# EasyEDA Pro project FPV_GROUND_STATION_SOURCE.epro

# Schematic Schematic1

## Sheets
1 POWER_BLK: Board Name: Board1; Create Date: 2026-05-17; Page Name: POWER_BLK; Project Name: JulyMonitor_uHAT; Schematic Name: Schematic1; Update Date: 2026-05-17; Company: EasyEDA.com; Page Size: A4; Version: V1.0
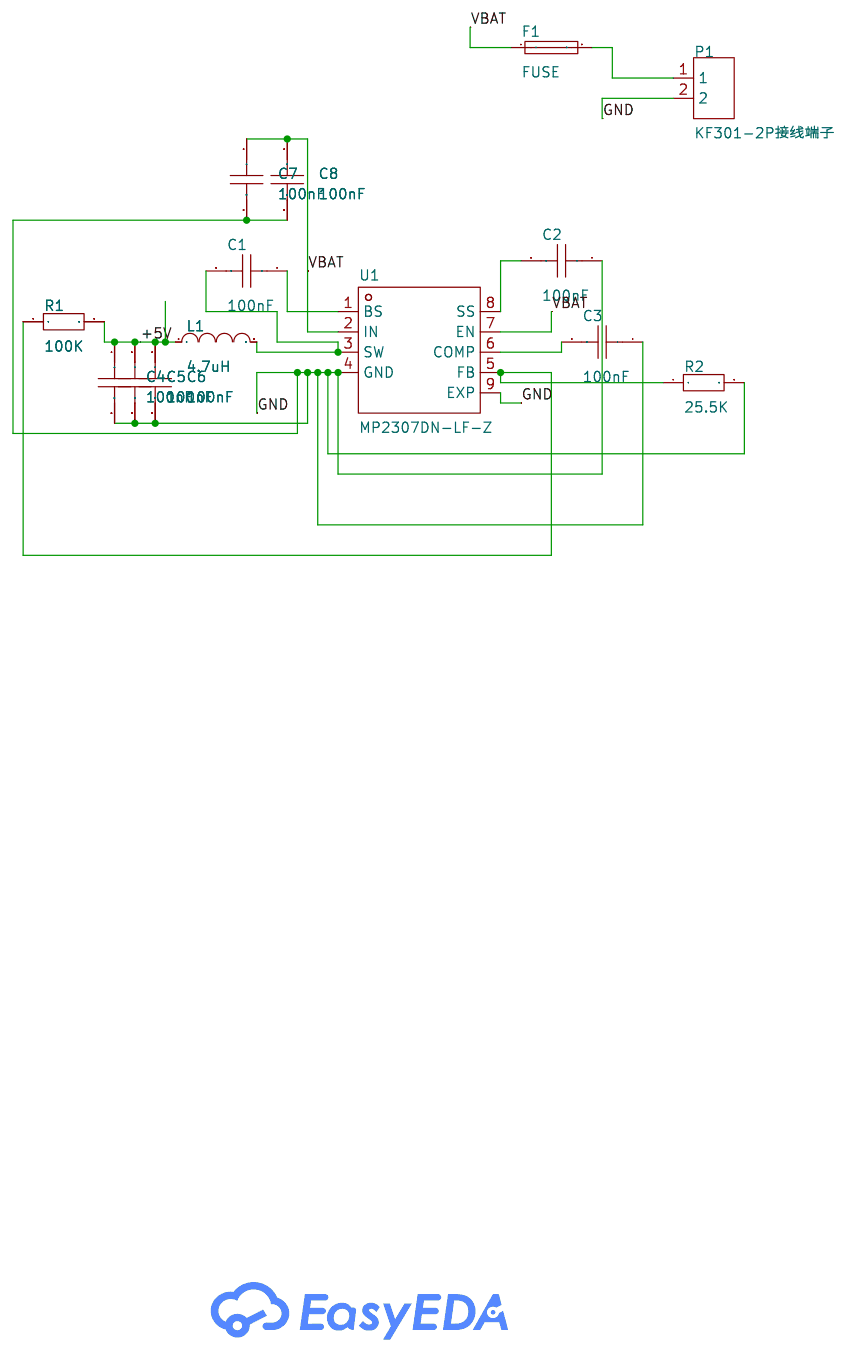
[diagram p0: POWER_BLK]
2 GPIO header + USB-A: Page Name: GPIO header + USB-A
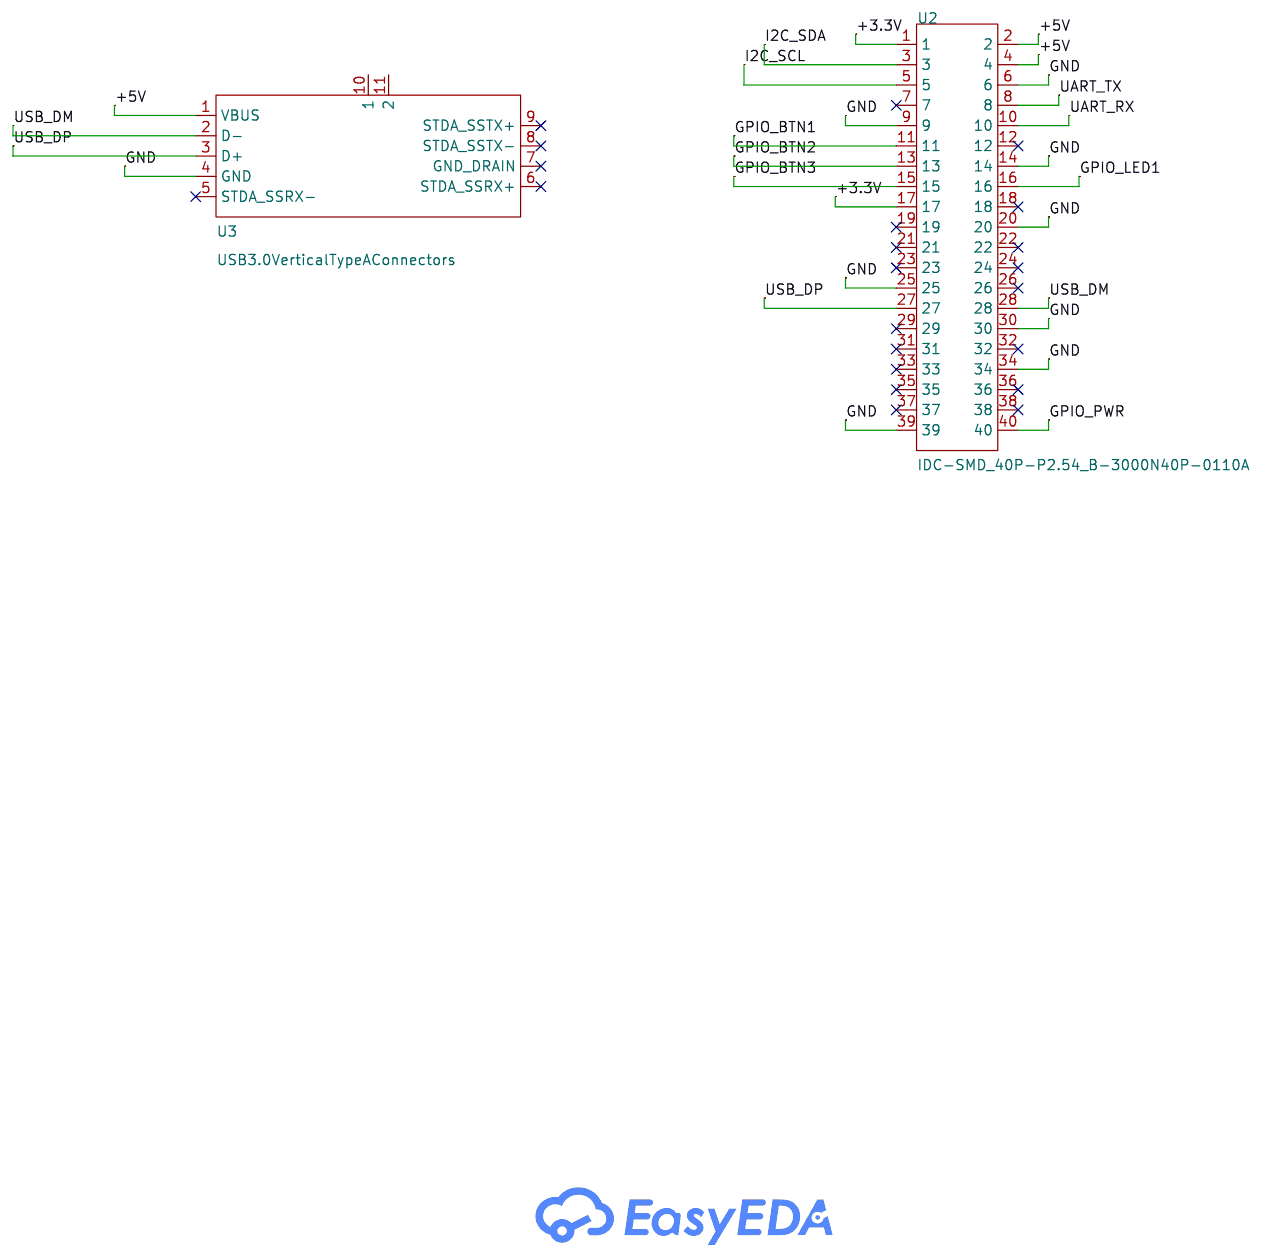
[diagram p1: GPIO header + USB-A]
3 LEDS AND OLED DISP: Page Name: LEDS AND OLED DISP
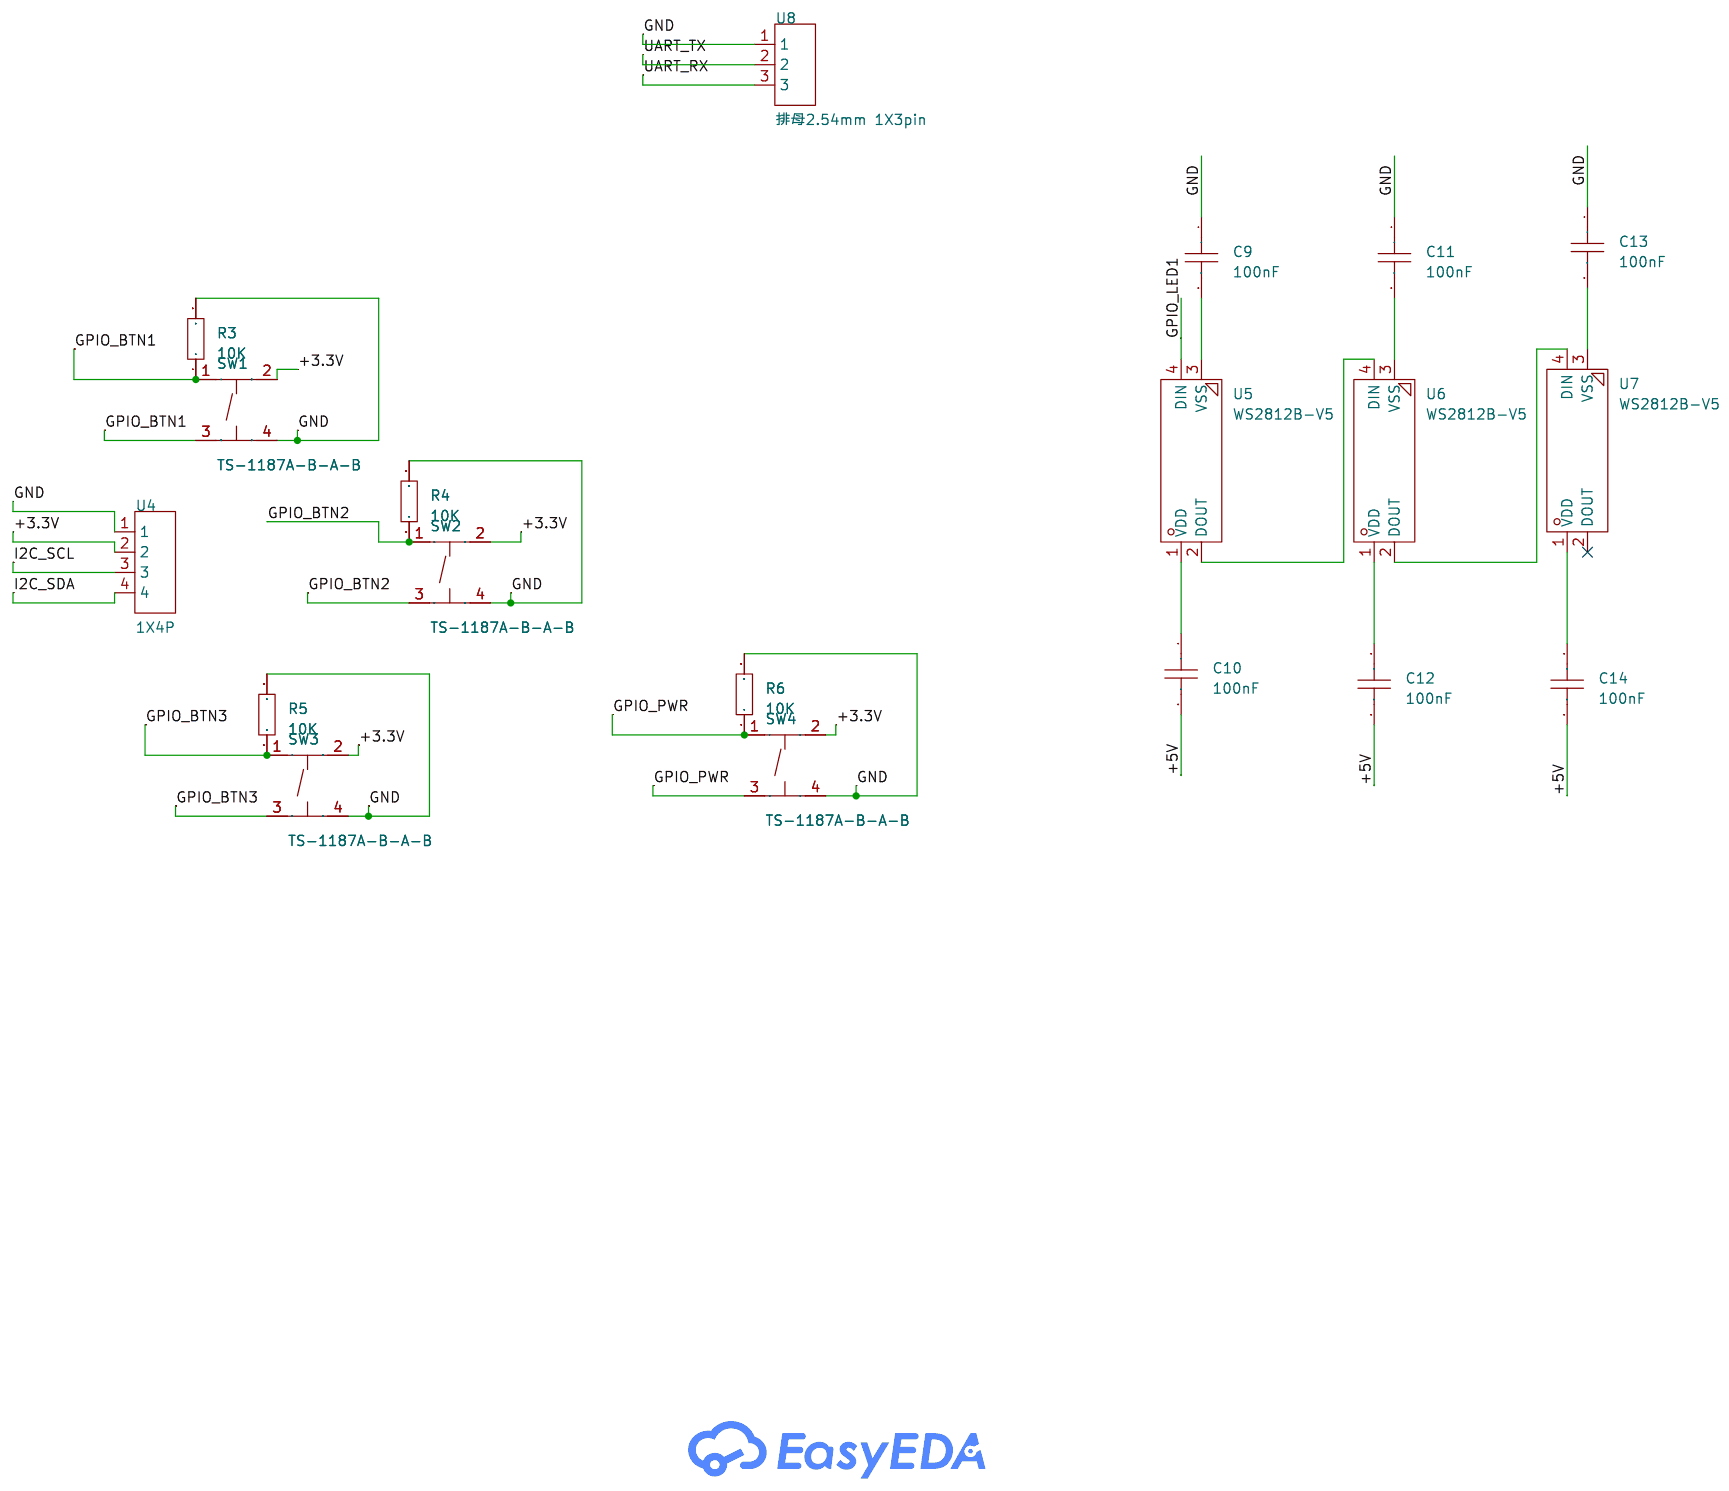
[diagram p2: LEDS AND OLED DISP]

## Parts
sheet GPIO header + USB-A
U2  IDC-SMD_40P-P2.54_B-3000N40P-0110A  [HDR-SMD_40P-P2.54-V-F-R2-C20-LS7.9]
U3  USB3.0VerticalTypeAConnectors  [USB-A-TH_C9900010398]
sheet LEDS AND OLED DISP
C9  100nF  [C0603]
C10  100nF  [C0603]
C11  100nF  [C0603]
C12  100nF  [C0603]
C13  100nF  [C0603]
C14  100nF  [C0603]
R3  10K  [R0603]
R4  10K  [R0603]
R5  10K  [R0603]
R6  10K  [R0603]
SW1  TS-1187A-B-A-B  [SW-SMD_4P-L5.1-W5.1-P3.70-LS6.5-TL_H1.5]
SW2  TS-1187A-B-A-B  [SW-SMD_4P-L5.1-W5.1-P3.70-LS6.5-TL_H1.5]
SW3  TS-1187A-B-A-B  [SW-SMD_4P-L5.1-W5.1-P3.70-LS6.5-TL_H1.5]
SW4  TS-1187A-B-A-B  [SW-SMD_4P-L5.1-W5.1-P3.70-LS6.5-TL_H1.5]
U4  1X4P  [CONN-TH_4P-P2.54_C9900022166]
U5  WS2812B-V5  [LED-SMD_4P-L5.0-W5.0-TL_WS2812B-B]
U6  WS2812B-V5  [LED-SMD_4P-L5.0-W5.0-TL_WS2812B-B]
U7  WS2812B-V5  [LED-SMD_4P-L5.0-W5.0-TL_WS2812B-B]
U8  排母2.54mm 1X3pin  [HDR-TH_3P-P2.54_CS-1165SDIG]
sheet POWER_BLK
C1  100nF  [C0603]
C2  100nF  [C0603]
C3  100nF  [C0603]
C4  100nF  [C0603]
C5  100nF  [C0603]
C6  100nF  [C0603]
C7  100nF  [C0603]
C8  100nF  [C0603]
F1  FUSE  [F1206]
L1  4.7uH  [L0603]
P1  KF301-2P接线端子  [CONN-TH_XY301V-A-5.0-2P]
R1  100K  [R0603]
R2  25.5K  [R0603]
U1  MP2307DN-LF-Z  [SOP-8_L4.9-W3.9-P1.27-LS6.0-BL-EP]

## Library data of the parts
U2 = IDC-SMD_40P-P2.54_B-3000N40P-0110A: Supplier Part: C9900016611; Supplier Footprint: 2.54mm2x20P; JLCPCB Part Class: Extended Part; Supplier: LCSC
U3 = USB3.0VerticalTypeAConnectors: Supplier Part: C9900010398; Supplier Footprint: USB3.0VerticalTypeA; JLCPCB Part Class: Extended Part; Supplier: LCSC
C1-C14 = CAP_0603: Supplier Footprint: 0603
R1-R6 = Res_0603: Supplier Footprint: 0603
SW1-SW4 = TS-1187A-B-A-B: Circuit:SPST Actuator Style:Round Button Operating Force:1.6N Mounting Type:Surface Mount,Vertical Length:5.1mm Width:5.1mm Switch Height:1.5mm with Bracket:Without Bracket Contact Current:50mA Voltage Rating:12V Actuator/Cap Color:Gold With Lamp:No Life:; LCSC Part Name: 5.1*5.1*1.5mm 立贴 轻触开关; Supplier Part: C318884; Manufacturer: XKB Connection(中国星坤); Supplier Footprint: SMD; JLCPCB Part Class: Basic Part; Datasheet: https://item.szlcsc.com/datasheet/TS-1187A-B-A-B/299976.html; Supplier: LCSC; Circuit: SPST; Actuator Style: Round Button; Operating Force: 1.6N; Mounting Type: Surface Mount,Vertical; Length: 5.1mm; Width: 5.1mm; Switch Height: 1.5mm; with Bracket: Without Bracket; Contact Current: 50mA; Voltage Rating: 12V; Actuator/Cap Color: Gold; With Lamp: No; Life: 100,000 Cycles; Operating Temperature: -30℃~+85℃
U4 = 1X4P: Supplier Part: C9900022166; Supplier Footprint: CONN-SMD-TH; JLCPCB Part Class: Extended Part; Supplier: LCSC
U5-U7 = WS2812B-V5: Supplier Part: C691873; Supplier Footprint: SMD,5x5mm; JLCPCB Part Class: Extended Part; Supplier: LCSC
U8 = 排母2.54mm 1X3pin: Supplier Part: C9900016709; JLCPCB Part Class: Extended Part; Supplier: LCSC
F1 = FUSE: Supplier Part: C9900021114; JLCPCB Part Class: Extended Part; Supplier: LCSC
L1 = L_0603
P1 = KF301-2P接线端子: Supplier Part: C9900016950; Supplier Footprint: CK301-2P; JLCPCB Part Class: Extended Part; Supplier: LCSC
U1 = MP2307DN-LF-Z: Function:Buck Voltage - Supply:4.75V~23V Voltage - Supply:4.75V~23V Output Voltage:925mV~20V Output Voltage:925mV~20V Output Current:3A Frequency - Switching:340kHz Frequency - Switching:340kHz Operating Temperature:-40℃~+85℃ Operating Temperature:-40℃~+8; LCSC Part Name: 3A，23V，340KHz同步整流降压转换器; Supplier Part: C18921; Manufacturer: MPS(芯源); Supplier Footprint: SOIC-8N-EP-150mil; JLCPCB Part Class: Extended Part; Datasheet: https://item.szlcsc.com/datasheet/MP2307DN-LF-Z/19624.html; Supplier: LCSC; Function: Buck; Voltage - Supply: 4.75V~23V; Output Voltage: 925mV~20V; Output Current: 3A; Frequency - Switching: 340kHz; Operating Temperature: -40℃~+85℃; Synchronous Rectifier: Yes; Number of Outputs: 1; Topology: Buck; Switch tube (built-in/external): Built-In; Output Type: Adjustable

## Nets
+3.3V: SW1.2(B) SW2.2(B) SW3.2(B) SW4.2(B) U2.1 U2.17 U4.2
+5V: C4.1 C5.1 C6.1 C10.2 C12.2 C14.2 L1.1 R1.2 U2.2 U2.4 U3.1(VBUS)
GND: C2.1 C3.1 C4.2 C5.2 C6.2 C7.2 C8.2 C9.1 C11.1 C13.1 P1.2 R2.2 R3.2 R4.2 R5.2 R6.2 SW1.4(D) SW2.4(D) SW3.4(D) SW4.4(D) U1.4(GND) U1.9(EXP) U2.6 U2.9 U2.14 U2.20 U2.25 U2.30 U2.34 U2.39 U3.4(GND) U4.1 U8.1
VBAT: C7.1 C8.1 F1.1 U1.2(IN) U1.7(EN)
GPIO_BTN1: R3.1 SW1.1(A) SW1.3(C) U2.11
GPIO_BTN2: R4.1 SW2.1(A) SW2.3(C) U2.13
GPIO_BTN3: R5.1 SW3.1(A) SW3.3(C) U2.15
GPIO_LED1: U2.16 U5.4(DIN)
GPIO_PWR: R6.1 SW4.1(A) SW4.3(C) U2.40
I2C_SCL: U2.5 U4.3
I2C_SDA: U2.3 U4.4
UART_RX: U2.10 U8.3
UART_TX: U2.8 U8.2
USB_DM: U2.28 U3.2(D-)
USB_DP: U2.27 U3.3(D+)
$1N198: F1.2 P1.1
$1N609: C1.2 L1.2 U1.3(SW)
$1N625: C1.1 U1.1(BS)
$1N643: C2.2 U1.8(SS)
$1N661: C3.2 U1.6(COMP)
$1N789: R1.1 R2.1 U1.5(FB)
$3N1279: C9.2 U5.3(VSS)
$3N1283: C11.2 U6.3(VSS)
$3N1287: C13.2 U7.3(VSS)
$3N1313: U5.2(DOUT) U6.4(DIN)
$3N1319: U6.2(DOUT) U7.4(DIN)
$3N1500: C10.1 U5.1(VDD)
$3N1509: C12.1 U6.1(VDD)
$3N1515: C14.1 U7.1(VDD)

Not connected (* = marked no-connect by the designer): U2 7* 12* 18* 19* 21* 22* 23* 24* 26* 29* 31* 32* 33* 35* 36* 37* 38*; U3 5(STDA_SSRX-)* 6(STDA_SSRX+)* 7(GND_DRAIN)* 8(STDA_SSTX-)* 9(STDA_SSTX+)* 10(1) 11(2); U7 2(DOUT)*

# Board PCB1
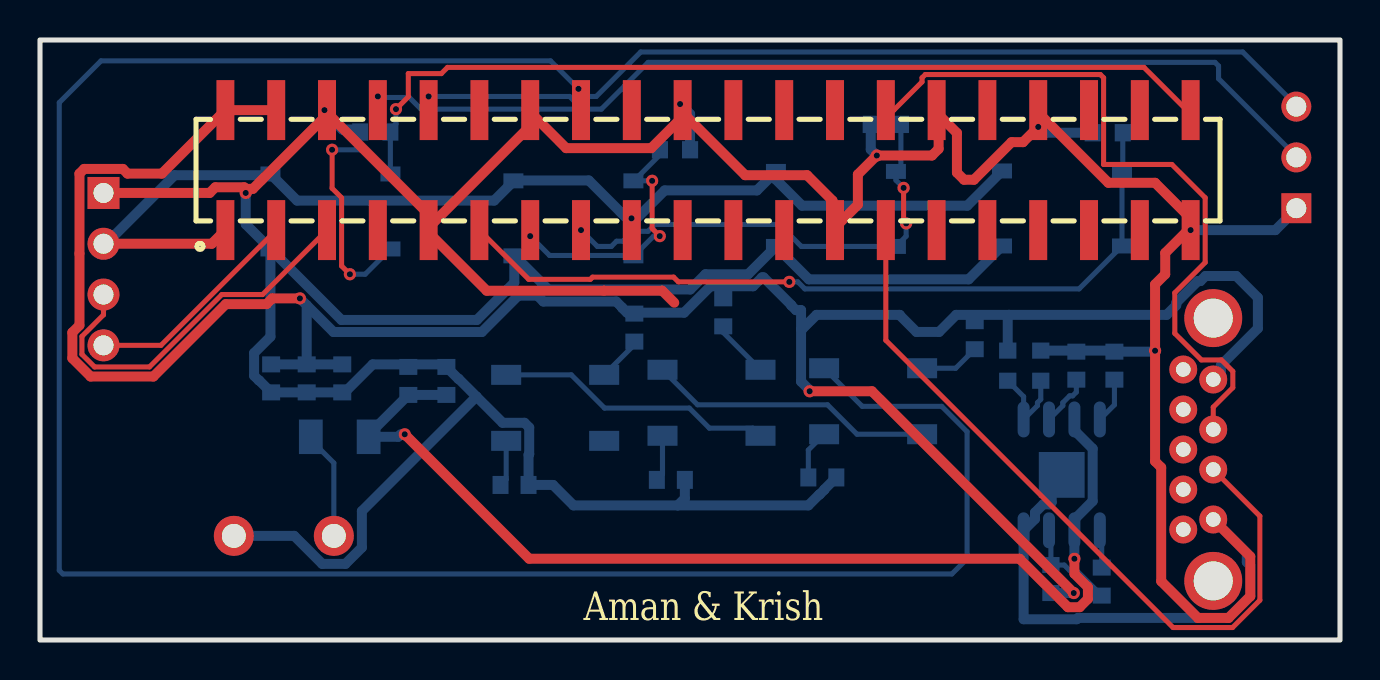
[diagram p3: board, top side]
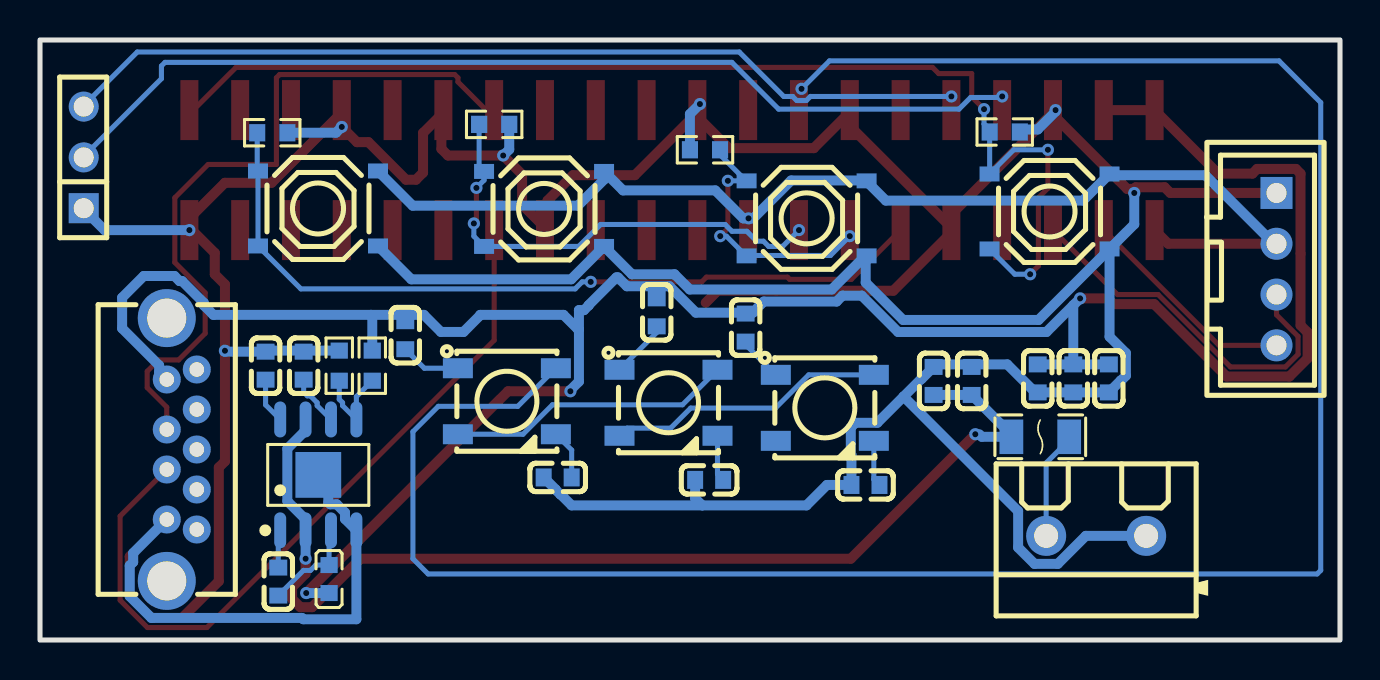
[diagram p4: board, bottom side, seen from below]

Outline 65 x 30 mm; copper layers: Top Layer, Bottom Layer. Coordinates in mm from the lower left corner of the outline.
Outline path: rectangle 0,30 65,0
Stack: Top Layer 0.035mm / Dielectric1 1.51mm FR4 er 4.5 / Bottom Layer 0.035mm

## Design rules (mm)
template: JLCPCB Capability(Two Layers Board)
spacing copperThickness1oz (default): track to track 0.102, other pairs 0.152 to 0.3
spacing copperThickness2oz: track to track 0.203, other pairs 0.152 to 0.3
track width copperThickness1oz (default): min 0.127, default 0.254, max 2.54
track width copperThickness2oz: min 0.203, default 0.254, max 2.54
differential pair differentialPair (default): width min 0.127, default 0.254, max 2.54; gap min 0.152, default 0.152
via viaSize (default): diameter min 0.5, default 0.61, max 10; hole min 0.3, default 0.305, max 6.3

## Placement (name value [footprint] x y rotation side)
C1  100nF  [C0603]  53.09 2.92 270 bottom
C2  100nF  [C0603]  53.72 13.72 270 bottom
C3  100nF  [C0603]  51.82 13.72 270 bottom
C4  100nF  [C0603]  13.34 13.08 270 bottom
C5  100nF  [C0603]  11.56 13.08 270 bottom
C6  100nF  [C0603]  15.11 13.08 270 bottom
C7  100nF  [C0603]  20.32 12.95 90 bottom
C8  100nF  [C0603]  18.41 12.95 90 bottom
C9  100nF  [C0603]  39.12 8.13 180 bottom
C10  100nF  [C0603]  46.74 15.24 90 bottom
C11  100nF  [C0603]  31.54 8.01 180 bottom
C12  100nF  [C0603]  34.16 16.38 90 bottom
C13  100nF  [C0603]  23.73 7.75 180 bottom
C14  100nF  [C0603]  29.72 15.62 90 bottom
F1  FUSE  [F1206]  14.99 10.16 180 bottom
L1  4.7uH  [L0603]  50.55 3.05 90 bottom
P1  KF301-2P接线端子  [CONN-TH_XY301V-A-5.0-2P]  12.19 5.21 180 bottom
R1  100K  [R0603]  48.39 13.72 90 bottom
R2  25.5K  [R0603]  50.04 13.72 90 bottom
R3  10K  [R0603]  53.39 25.36 180 bottom
R4  10K  [R0603]  31.75 24.51 0 bottom
R5  10K  [R0603]  42.29 25.78 180 bottom
R6  10K  [R0603]  16.76 25.4 180 bottom
SW1  TS-1187A-B-A-B  [SW-SMD_4P-L5.1-W5.1-P3.70-LS6.5-TL_H1.5]  51.1 21.58 180 bottom
SW2  TS-1187A-B-A-B  [SW-SMD_4P-L5.1-W5.1-P3.70-LS6.5-TL_H1.5]  26.67 21.08 180 bottom
SW3  TS-1187A-B-A-B  [SW-SMD_4P-L5.1-W5.1-P3.70-LS6.5-TL_H1.5]  39.8 21.55 180 bottom
SW4  TS-1187A-B-A-B  [SW-SMD_4P-L5.1-W5.1-P3.70-LS6.5-TL_H1.5]  14.52 21.43 180 bottom
U1  MP2307DN-LF-Z  [SOP-8_L4.9-W3.9-P1.27-LS6.0-BL-EP]  51.09 8.25 180 bottom
U2  IDC-SMD_40P-P2.54_B-3000N40P-0110A  [HDR-SMD_40P-P2.54-V-F-R2-C20-LS7.9]  33.4 23.49 0 top
U3  USB3.0VerticalTypeAConnectors  [USB-A-TH_C9900010398]  57.91 9.52 270 bottom
U4  1X4P  [CONN-TH_4P-P2.54_C9900022166]  3.17 18.54 270 bottom
U5  WS2812B-V5  [LED-SMD_4P-L5.0-W5.0-TL_WS2812B-B]  41.66 11.94 180 bottom
U6  WS2812B-V5  [LED-SMD_4P-L5.0-W5.0-TL_WS2812B-B]  33.57 11.86 180 bottom
U7  WS2812B-V5  [LED-SMD_4P-L5.0-W5.0-TL_WS2812B-B]  25.76 11.61 180 bottom
U8  排母2.54mm 1X3pin  [HDR-TH_3P-P2.54_CS-1165SDIG]  62.81 24.13 90 bottom

## Footprints (pads in the part's own frame, mm; a bottom-side part is the same pattern mirrored in y, then rotated)
C0603
  rect 0.8x0.9 smd: 1(-0.7,0) 2(0.7,0)
CONN-TH_4P-P2.54_C9900022166
  rect 1.6x1.6 hole 1: 1(-3.81,0)
  round 1.6 hole 1: 2(-1.27,0) 3(1.27,0) 4(3.81,0)
CONN-TH_XY301V-A-5.0-2P
  round 2 hole 1.2: 1(-2.5,0) 2(2.5,0)
F1206
  rect 1.19x1.728 smd: 1(-1.445,0) 2(1.445,0)
HDR-SMD_40P-P2.54-V-F-R2-C20-LS7.9
  rect 0.9x3 smd: 1(-24.13,-3) 2(-24.13,3) 3(-21.59,-3) 4(-21.59,3) 5(-19.05,-3) 6(-19.05,3) 7(-16.51,-3) 8(-16.51,3) 9(-13.97,-3) 10(-13.97,3) 11(-11.43,-3) 12(-11.43,3) 13(-8.89,-3) 14(-8.89,3) 15(-6.35,-3) 16(-6.35,3) 17(-3.81,-3) 18(-3.81,3) 19(-1.27,-3) 20(-1.27,3) 21(1.27,-3) 22(1.27,3) 23(3.81,-3) 24(3.81,3) 25(6.35,-3) 26(6.35,3) 27(8.89,-3) 28(8.89,3) 29(11.43,-3) 30(11.43,3) 31(13.97,-3) 32(13.97,3) 33(16.51,-3) 34(16.51,3) 35(19.05,-3) 36(19.05,3) 37(21.59,-3) 38(21.59,3) 39(24.13,-3) 40(24.13,3)
HDR-TH_3P-P2.54_CS-1165SDIG
  rect 1.5x1.5 hole 1: 1(-2.54,0)
  round 1.5 hole 1: 2(0,0) 3(2.54,0)
L0603
  rect 0.8x0.864 smd: 1(-0.7,0) 2(0.7,0)
LED-SMD_4P-L5.0-W5.0-TL_WS2812B-B
  rect 1.5x1 smd: 1(-2.45,1.65) 2(-2.45,-1.65) 3(2.45,-1.65) 4(2.45,1.65)
R0603
  rect 0.806x0.864 smd: 1(-0.753,0) 2(0.753,0)
SOP-8_L4.9-W3.9-P1.27-LS6.0-BL-EP
  oval 0.6x1.8 smd: 1(-1.905,-2.772) 2(-0.635,-2.772) 3(0.635,-2.772) 4(1.905,-2.772) 5(1.905,2.772) 6(0.635,2.772) 7(-0.635,2.772) 8(-1.905,2.772)
  rect 2.29x2.29 smd: 9(0,0)
SW-SMD_4P-L5.1-W5.1-P3.70-LS6.5-TL_H1.5
  rect 1x0.75 smd: 1(-3,1.875) 2(3,1.875) 3(-3,-1.875) 4(3,-1.875)
USB-A-TH_C9900010398
  round 1.4 hole 0.73: 1(-3.5,-0.75) 2(-1,-0.75) 3(1,-0.75) 4(3.5,-0.75) 5(4,0.75) 6(2,0.75) 7(0,0.75) 8(-2,0.75) 9(-4,0.75)
  round 2.9 hole 1.95: 10(-6.57,-0.75) 11(6.57,-0.75)

## Nets
As in the schematic.

Pads without a net: U2 7 12 18 19 21 22 23 24 26 29 31 32 33 35 36 37 38; U3 5 6 7 8 9 10 11; U7 2

## Via types
v1: diameter 0.61, hole 0.305, Top Layer to Bottom Layer, 26 vias

## Routing (per net, layer and track width the routed paths; a pad name or vN(x,y) marks a point on that pad's centre or on a via; arc(x,y) is an arc through that point)
+3.3V: length 57.1
  Top Layer w0.5: U4.2 8.59,19.81 9.27,20.49
  Bottom Layer w0.5: SW1.2 46.37,21.72 38.1,21.72 36.8,23.02 SW3.2 35.85,22.48 31.23,22.48 29.84,21.08 29.34,21.08 27.44,22.98 23.72,22.98 22.71,21.97 12.85,21.97 SW4.2 11.46,23.24 6.73,23.24 3.3,19.81 U4.2
  vias: v1(29.57,21.08)
+5V: length 123.7
  Top Layer w0.5: U2.4 9.27,26.49 6.09,23.32 4.38,23.32 4.14,23.55 2.21,23.55 1.97,23.32 1.97,15.73 1.62,15.38 1.62,14.09 2.53,13.17 5.67,13.17 9.29,16.79 11.33,16.79 11.61,17.08 v1(12.99,17.08) ; v1(51.69,2.35) 41.6,12.44 v1(38.48,12.44)
  Bottom Layer w0.5: 13.34,16.74 14.67,15.4 22.09,15.4 23.91,17.22 24.87,17.22 25.17,16.92 28.81,16.92 29.11,16.62 29.11,16.6 29.35,16.37 32.2,16.37 33.52,17.69 35.66,17.69 36.1,18.13 36.18,18.13 37.56,16.75 37.56,16.73 37.8,16.49 38.05,16.49 38.05,16.48 38.05,15.54 ; 13.34,16.74 v1(12.99,17.08) ; 13.34,16.74 C4.1 ; R1.2 48.39,16.19 48.45,16.26 ; C4.1 C5.1 ; C4.1 C6.1 ; 48.45,16.26 56.33,16.26 56.81,16.73 56.81,16.86 57.9,17.95 58.02,17.95 58.28,18.2 59.81,18.2 60.9,17.12 60.9,15.58 59.04,13.73 59.04,13.41 U3.1 ; 48.45,16.26 45.81,16.26 44.95,15.4 43.82,15.4 42.99,16.24 42.99,16.26 38.82,16.26 38.11,15.54 38.05,15.54 ; 38.05,15.54 38.05,12.92 38.48,12.49 v1(38.48,12.44) ; L1.1 v1(51.69,2.35)
GND: length 273.4
  Top Layer w0.254: v1(10.29,22.35) 10.29,22.56
  Top Layer w0.5: 44.93,26.27 44.93,24.56 44.6,24.22 v1(41.84,24.22) 40.89,23.28 40.89,21.77 39.62,20.49 39.62,21.97 38.35,23.24 35.26,23.24 32.25,26.25 32.22,26.25 30.56,24.59 26.31,24.59 24.41,26.49 24.38,26.49 24.38,25.57 19.3,20.49 ; 44.93,26.27 45.85,25.35 45.85,23.37 46.2,23.01 46.7,23.01 48.58,24.89 49.15,24.89 49.78,25.53 49.78,26.49 53.42,22.86 55.75,22.86 57.4,21.21 57.4,20.49 56.26,19.35 56.26,18.29 55.75,17.78 v1(55.75,14.46) 55.75,8.93 56.06,8.63 56.06,2.94 57.9,1.1 59.43,1.1 60.51,2.19 60.51,4.17 U3.4 ; 44.93,26.27 44.7,26.49 ; 19.3,20.49 22.34,17.46 31.12,17.46 31.71,16.87 ; 19.3,20.49 19.3,21.41 v1(14.22,26.49) 14.22,26.14 10.65,22.56 10.29,22.56 10.21,22.64 8.77,22.64 8.48,22.35 U4.1
  Bottom Layer w0.5: SW4.4 15.07,16 21.84,16 23.72,17.87 23.72,19.23 25.42,17.53 32.51,17.53 33.27,18.29 35.41,18.29 SW3.4 38.44,18.03 46.43,18.03 SW1.4 ; SW4.4 11.52,15.16 10.71,14.35 10.71,13.21 10.94,12.98 10.96,12.98 C5.2 C4.2 C6.2 15.24,12.38 16.64,13.78 20.19,13.78 C7.2 20.92,13.06 20.94,13.06 21.82,12.17 ; SW4.4 10.29,20.79 v1(10.29,22.35) ; 50.59,7.75 50.59,6.89 50.48,6.78 50.16,6.78 49.75,6.37 49.75,6.05 U1.4 49.18,1.04 51.84,1.04 51.9,1.1 59.43,1.1 60.51,2.19 60.51,3.72 60.34,3.89 60.34,4.35 U3.4 ; 55.75,14.42 C2.1 53.67,14.47 R2.2 ; C9.1 39.22,7.53 39.22,7.51 38.98,7.28 38.96,7.28 38.42,6.73 31.89,6.73 ; 21.82,12.17 23.13,10.86 24.23,10.86 24.46,10.62 24.46,9.29 24.43,9.26 C13.1 25.65,7.75 26.68,6.73 31.89,6.73 ; 21.82,12.17 16.09,6.44 16.09,4.63 15.27,3.8 14.11,3.8 12.71,5.21 P1.2 ; v1(32,26.8) 32.5,26.3 R4.2 ; v1(41.84,24.22) 41.54,24.53 R5.2 ; 16.01,25.53 15.11,25.53 14.22,26.42 ; 31.89,6.73 32.24,7.08 C11.1 ; v1(57.53,20.49) 61.77,20.49 62.87,21.59 ; v1(49.91,25.65) 50.2,25.36 R3.2
VBAT: length 54.4
  Top Layer w0.5: v1(18.24,10.29) 24.46,4.06 48.97,4.06 51.4,1.64 51.98,1.64 52.4,2.06 52.4,2.64 51.72,3.32 v1(51.72,4.06)
  Bottom Layer w0.5: v1(51.72,4.06) U1.2 51.72,6.03 52.63,6.94 52.63,9.57 51.72,10.48 U1.7 ; C7.1 C8.1 16.43,10.27 16.43,10.16 17.91,10.16 18.03,10.29
GPIO_BTN1: length 40
  Top Layer w0.254: v1(37.47,17.91) 31.92,17.91 31.68,18.14 27.63,18.14 27.52,18.03 24.43,18.03 U2.11
  Bottom Layer w0.254: R3.1 54.14,23.49 SW1.1 SW1.3 51.95,17.55 38.24,17.55 37.89,17.91 v1(37.47,17.91)
GPIO_BTN2: length 13.2
  Top Layer w0.254: v1(30.99,20.19) 30.61,20.57 v1(30.61,22.96)
  Bottom Layer w0.254: v1(30.99,20.19) 30.68,20.19 29.72,19.23 25.48,19.23 v1(24.51,20.19) ; v1(30.61,22.96) 29.73,22.96 29.72,22.98 31,24.26 R4.1
GPIO_BTN3: length 23.6
  Top Layer w0.254: v1(43.18,22.61) 43.18,20.95 v1(43.31,20.83)
  Bottom Layer w0.254: v1(27.05,20.49) 27.87,19.68 28.57,19.68 28.83,19.94 29.16,19.94 29.65,20.43 30.4,20.43 30.75,20.78 36.97,20.78 38.07,19.68 SW3.3 43.31,20.19 v1(43.31,20.83) ; R5.1 43.04,23.68 SW3.1 42.8,22.99 v1(43.18,22.61)
GPIO_LED1: length 111.4
  Bottom Layer w0.254: U5.4 41.11,11.68 45.09,11.68 46.35,10.41 46.35,4.06 45.59,3.3 1.14,3.3 0.96,3.48 0.96,26.87 3.05,28.96 25.53,28.96 v1(26.92,27.56)
GPIO_PWR: length 58.1
  Top Layer w0.254: v1(17.8,26.54) 18.41,27.16 18.41,28.32 20.07,28.32 20.38,28.63 55.2,28.63 57.34,26.49 U2.40 ; v1(14.6,24.51) 14.6,22.59 15.08,22.11 15.08,18.7 v1(15.49,18.29)
  Bottom Layer w0.254: v1(15.49,18.29) 16.26,18.29 SW4.3 ; v1(14.6,24.51) 16.31,24.51 17.52,23.31 ; 17.52,23.31 17.52,25.53 17.8,25.81 v1(17.8,26.54) ; 17.52,23.31 SW4.1
I2C_SCL: length 18.8
  Top Layer w0.254: U2.5 11.13,17.27 9.09,17.27 5.47,13.65 2.73,13.65 2.1,14.28 2.1,15.18 3.17,16.26 U4.3
I2C_SDA: length 11
  Top Layer w0.254: U2.3 6.05,14.73 U4.4
UART_RX: length 45.7
  Bottom Layer w0.254: 62.87,26.67 60.13,29.4 30.04,29.4 27.81,27.18 27.37,27.18 27.17,26.97 26.68,26.97 26.48,27.18 v1(19.43,27.18)
UART_TX: length 49.5
  Bottom Layer w0.254: v1(16.89,27.18) 16.94,27.13 18.47,27.13 19.05,26.54 28.07,26.54 30.41,28.88 58.75,28.88 58.93,28.7 58.93,28.07 62.87,24.13
USB_DM: length 36.3
  Top Layer w0.254: U3.2 58.66,11.64 59.64,12.62 59.64,13.43 59.07,14 58.07,14 56.74,15.33 56.74,17.36 58.26,18.88 58.26,22.11 56.59,23.78 53.18,23.78 53.18,28.11 53.02,28.27 44.27,28.27 44.1,28.11 44.1,27.91 42.69,26.49 U2.28
USB_DP: length 38.2
  Top Layer w0.254: U3.3 60.99,6.19 60.99,1.99 59.63,0.62 56.65,0.62 42.29,14.99 U2.27
$1N198: length 5.5
  Bottom Layer w0.254: P1.1 14.69,8.85 13.38,10.16
$1N609: length 4.9
  Bottom Layer w0.254: U1.3 50.55,5.39 L1.2 51.21,3.75 51.48,3.48 51.83,3.48 C1.2
$1N625: length 1.9
  Bottom Layer w0.254: U1.1 53.09,5.39 C1.1
$1N643: length 2.3
  Bottom Layer w0.254: C2.2 53.72,11.76 U1.8
$1N661: length 2.6
  Bottom Layer w0.254: U1.6 51.14,11.72 51.14,11.87 51.48,12.21 51.63,12.21 51.82,12.39 C3.2
$1N789: length 4.6
  Bottom Layer w0.254: R1.1 49.18,12.17 U1.5 49.87,11.72 49.87,11.87 50.04,12.03 R2.1
$3N1279: length 2.5
  Bottom Layer w0.254: U5.3 38.42,9.5 C9.2
$3N1283: length 2.3
  Bottom Layer w0.254: U6.3 31.12,8.29 C11.2
$3N1287: length 2.3
  Bottom Layer w0.254: U7.3 23.31,8.03 C13.2
$3N1313: length 14.3
  Bottom Layer w0.254: U5.2 40.85,10.29 39.38,11.76 32.88,11.76 U6.4
$3N1319: length 14
  Bottom Layer w0.254: U7.4 26.56,13.26 28.23,11.6 32.47,11.6 33.47,10.59 35.65,10.59 U6.2
$3N1500: length 3
  Bottom Layer w0.254: U5.1 45.78,13.59 C10.1
$3N1509: length 2.9
  Bottom Layer w0.254: U6.1 34.16,15.37 C12.1
$3N1515: length 2.3
  Bottom Layer w0.254: U7.1 29.72,14.77 C14.1

## Text on the board
Top Silkscreen Layer: Aman & Krish
